# Altium project ultrasonic_tank_monitor.PrjPcb
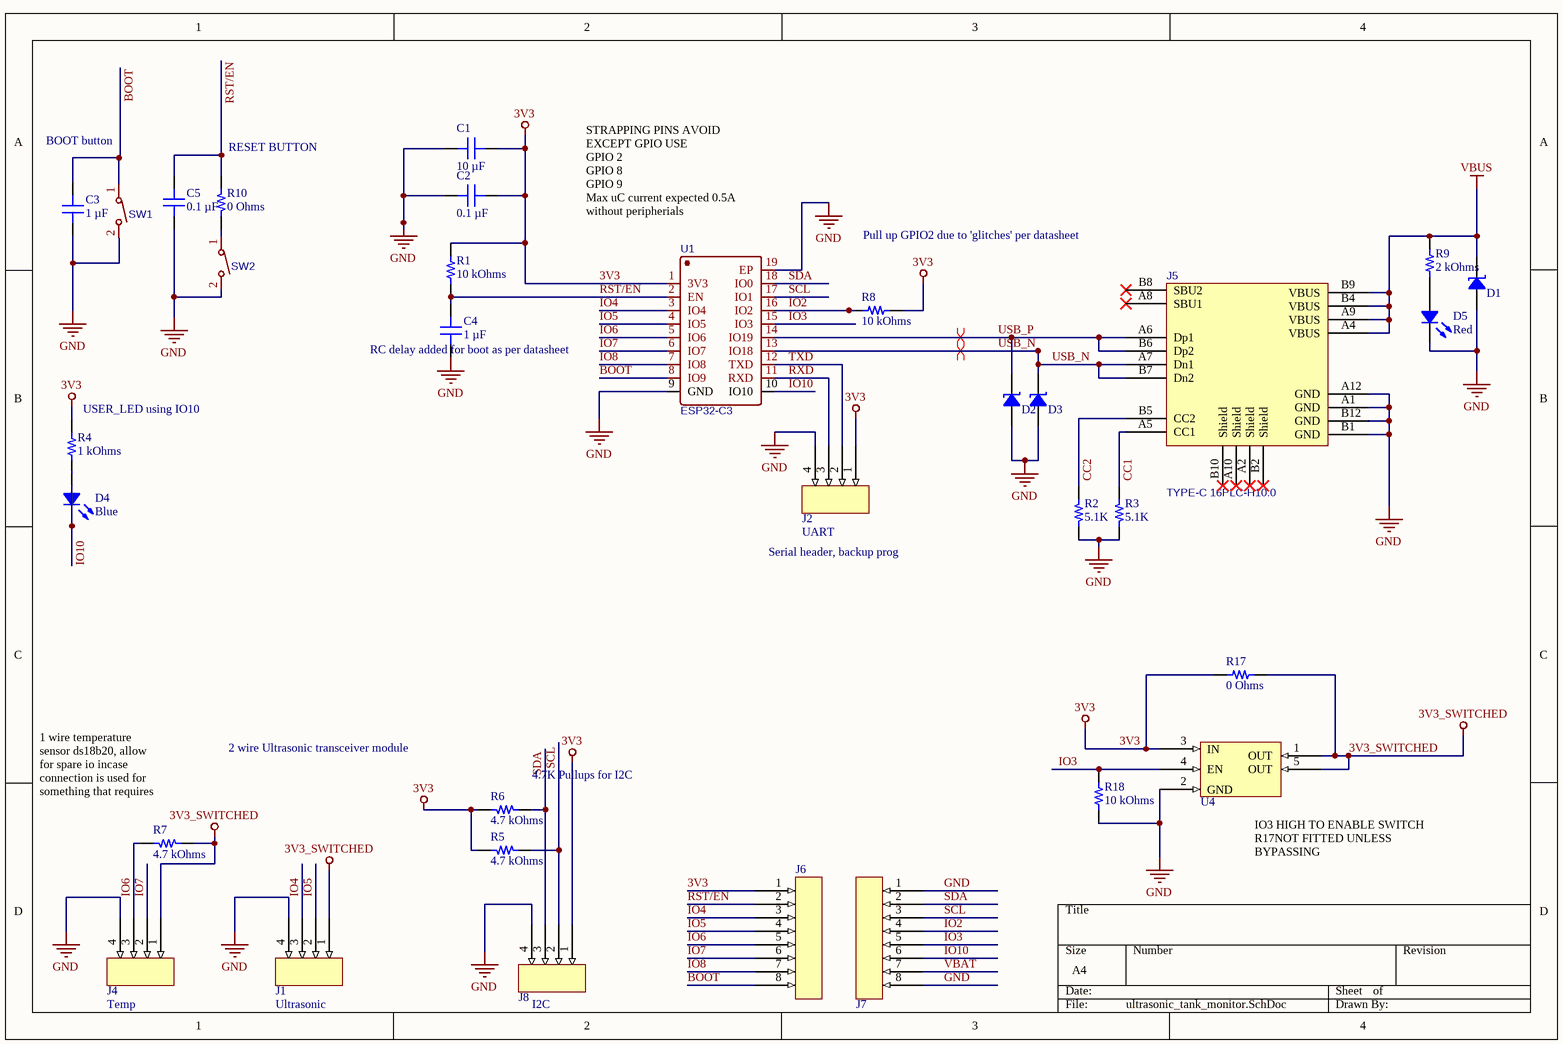
[diagram p0: ultrasonic_tank_monitor.SchDoc]
3 sheets, 63 parts. Net scope: global (net labels, ports and power ports of the same name join across sheets).
Board file: ultrasonic_tank_monitor.PcbDoc
Sheets:
  ultrasonic_tank_monitor.SchDoc
  ultrasonic_tank_monitor_power.SchDoc
  ultrasonic_tank_monitor_battery.SchDoc

## Sheet ultrasonic_tank_monitor.SchDoc
size A4; SheetNumber: 1; SheetTotal: 3

### Parts
C1  10 µF  [CAP 0603_1608]
C2  0.1 µF  [CAP 0603_1608]
C3  1 µF  [CAP 0603_1608]
C4  1 µF  [CAP 0603_1608]
C5  0.1 µF  [CAP 0603_1608]
D1  VESD16C1-02V-G3-08  [SOD523F]  (value not drawn)
D2  VESD16C1-02V-G3-08  [SOD523F]  (value not drawn)
D3  VESD16C1-02V-G3-08  [SOD523F]  (value not drawn)
D4  Blue  [LED 0805_2012 BLUE]
D5  Red  [LED 0805_2012 RED]
J1  Ultrasonic  [HDR-TH_4P-P2.54-V-M]
J2  UART  [HDR-TH_4P-P2.54-V-M]
J4  Temp  [HDR-TH_4P-P2.54-V-M]
J5  TYPE-C 16PLC-H10.0  [TYPE-C-TH_16PLC-H10.0]
J6  HDR-TH_8P-P2.54  [HDR-TH_8P-P2.54-V-M]  (value not drawn)
J7  HDR-TH_8P-P2.54  [HDR-TH_8P-P2.54-V-M]  (value not drawn)
J8  I2C  [HDR-TH_4P-P2.54-V-M]
R1  10 kOhms  [RES 0603_1608]
R2  5.1K  [RES 0603_1608]
R3  5.1K  [RES 0603_1608]
R4  1 kOhms  [RES 0603_1608]
R5  4.7 kOhms  [RES 0603_1608]
R6  4.7 kOhms  [RES 0603_1608]
R7  4.7 kOhms  [RES 0603_1608]
R8  10 kOhms  [RES 0603_1608]
R9  2 kOhms  [RES 0603_1608]
R10  0 Ohms  [RES 0603_1608]
R17  0 Ohms  [RES 1206_3216]
R18  10 kOhms  [RES 0603_1608]
SW1  TS-1185-B-A-B-A  [SW-SMD_L4.0-W3.0-LS5.0]  (value not drawn)
SW2  TS-1185-B-A-B-A  [SW-SMD_L4.0-W3.0-LS5.0]  (value not drawn)
U1  ESP32-C3  [BULETM-SMD_ESPRESSIF_ESP32-C3-WROOM-02-N4-4MB]
U4  AP22818AKBWT-7  [SOT-23-5_L2.9-W1.6-P0.95-LS2.8-BR]  (value not drawn)

### Nets
3V3: C1.2 C2.2 J2.1 J6.1 J8.1 R1.1 R4.2 R5.2 R6.2 R8.2 R17.1 U1.1(3V3) U4.3(IN)
3V3_SWITCHED: J1.1 J4.1 R7.1 R17.2 U4.1(OUT) U4.5(OUT)
GND: C1.1 C2.1 C3.1 C4.1 C5.1 D1.1 D2.1 D3.1 D5.2 J1.4 J2.4 J4.4 J5.A1(GND) J5.A12(GND) J5.B1(GND) J5.B12(GND) J7.1 J7.8 J8.4 R2.1 R3.1 R18.2 SW1.2 SW2.2 U1.9(GND) U1.19(EP) U4.2(GND)
VBAT: J7.7
VBUS: D1.2 J5.A4(VBUS) J5.A9(VBUS) J5.B4(VBUS) J5.B9(VBUS) R9.2
BOOT: C3.2 J6.8 SW1.1 U1.8(IO9)
CC1: J5.A5(CC1) R3.2
CC2: J5.B5(CC2) R2.2
IO2: J7.4 R8.1 U1.16(IO2)
IO3: J7.5 R18.1 U1.15(IO3) U4.4(EN)
IO4: J1.3 J6.3 U1.3(IO4)
IO5: J1.2 J6.4 U1.4(IO5)
IO6: J4.3 J6.5 R7.2 U1.5(IO6)
IO7: J4.2 J6.6 U1.6(IO7)
IO8: J6.7 U1.7(IO8)
IO10: D4.2 J7.6 U1.10(IO10)
RST/EN: C4.2 C5.2 J6.2 R1.2 R10.2 U1.2(EN)
RXD: J2.3 U1.11(RXD)
SCL: J7.3 J8.2 R5.1 U1.17(IO1)
SDA: J7.2 J8.3 R6.1 U1.18(IO0)
TXD: J2.2 U1.12(TXD)
USB_N: D3.2 J5.A7(Dn1) J5.B7(Dn2) U1.13(IO18)
USB_P: D2.2 J5.A6(Dp1) J5.B6(Dp2) U1.14(IO19)
NetD4_1: D4.1 R4.1
NetD5_1: D5.1 R9.1
NetR10_1: R10.1 SW2.1

Not connected (* = marked no-connect by the designer): J5 A2(Shield)* A8(SBU1)* A10(Shield)* B2(Shield)* B8(SBU2)* B10(Shield)*

### Layout directives
differential pair: USB_N, USB_P

### Notes on the sheet
- BOOT button
- (near R10) RESET BUTTON
- (near U1) STRAPPING PINS AVOID EXCEPT GPIO USE
  GPIO 2
  GPIO 8
  GPIO 9
  Max uC current expected 0.5A without peripherials
- Pull up GPIO2 due to 'glitches' per datasheet
- (near C4) RC delay added for boot as per datasheet
- (near R4) USER_LED using IO10
- Serial header, backup prog
- (near R7) 1 wire temperature sensor ds18b20, allow for spare io incase connection is used for something that requires 2 wire
- 2 wire Ultrasonic transceiver module
- (near R6) 4.7K Pullups for I2C
- (near U4) IO3 HIGH TO ENABLE SWITCH
  R17NOT FITTED UNLESS BYPASSING

### Library data of the parts
C1 = GRM188R61A106ME69D: CAP CER 10UF 10V X5R 0603; manufacturer: Murata Electronics; Tolerance: ±20%; Part Number: GRM188R61A106ME69D; Value: 10 µF; Applications: General Purpose; Capacitance: 10 µF; componentlink1description: Datasheet; componentlink1url: https://search.murata.co.jp/Ceramy/image/img/A01X/G101/ENG/GRM188R61A106ME69-01.pdf; componentlink2description: DigiKey Link; componentlink2url: https://www.digikey.com/en/products/detail/murata-electronics/GRM188R61A106ME69D/5027560; Device Package: 0603 (1608 Metric); lastupdated: 3/06/2023 7:12:12 PM; Lifecycle Status: Active; Minimum Order: 1; Mounting Type: Surface Mount, MLCC; Operating Temperature: -55°C ~ 85°C; Package / Case: 0603 (1608 Metric); packaging: TapeAndReel; partid: 11157; Part Status: Active; price: 0.01; series: GRM; Size / Dimension: 0.063" L x 0.031" W (1.60mm x 0.80mm); Supplier 1: DigiKey; Supplier Part Number 1: 490-10475-1-ND; Temperature Coefficient: X5R; Thickness (Max): 0.037" (0.95mm); Voltage - Rated: 10V
C2 C5 = VJ0603Y104MXQCW1BC: CAP CER 0.1UF 10V X7R 0603; manufacturer: Vishay Vitramon; Tolerance: ±20%; Part Number: VJ0603Y104MXQCW1BC; Value: 0.1 µF; Applications: General Purpose; Capacitance: 0.1 µF; componentlink1description: Datasheet; componentlink1url: https://www.vishay.com/docs/28548/vjw1bcbascomseries.pdf; componentlink2description: DigiKey Link; componentlink2url: https://www.digikey.com/en/products/detail/vishay-vitramon/VJ0603Y104MXQCW1BC/8305323; Device Package: 0603 (1608 Metric); lastupdated: 3/06/2023 7:11:16 PM; Lifecycle Status: Active; Minimum Order: 1; Mounting Type: Surface Mount, MLCC; Operating Temperature: -55°C ~ 125°C; Package / Case: 0603 (1608 Metric); packaging: TapeAndReel; partid: 34594; Part Status: Active; price: 0.01; series: VJ W1BC; Size / Dimension: 0.063" L x 0.031" W (1.60mm x 0.80mm); Supplier 1: DigiKey; Supplier Part Number 1: 720-VJ0603Y104MXQCW1BCCT-ND; Temperature Coefficient: X7R; Thickness (Max): 0.034" (0.87mm); Voltage - Rated: 10V
C3 C4 = LMK107B7105KAHT: CAP CER 1UF 10V X7R 0603; manufacturer: Taiyo Yuden; Tolerance: ±10%; Part Number: LMK107B7105KAHT; Value: 1 µF; Applications: Automotive; Capacitance: 1 µF; componentlink1description: Datasheet; componentlink1url: https://ds.yuden.co.jp/TYCOMPAS/ut/detail?pn=LMK107B7105KAHT  &u=M; componentlink2description: DigiKey Link; componentlink2url: https://www.digikey.com/en/products/detail/taiyo-yuden/LMK107B7105KAHT/4157759; Device Package: 0603 (1608 Metric); Lifecycle Status: Active; Minimum Order: 1; Mounting Type: Surface Mount, MLCC; Operating Temperature: -55°C ~ 125°C; Package / Case: 0603 (1608 Metric); packaging: TapeAndReel; partid: 13032; Part Status: Active; price: 0.01; Ratings: AEC-Q200; series: M; Size / Dimension: 0.063" L x 0.031" W (1.60mm x 0.80mm); Supplier 1: DigiKey; Supplier Part Number 1: 587-3410-1-ND; Temperature Coefficient: X7R; Thickness (Max): 0.035" (0.90mm); Voltage - Rated: 10V
  C3: lastupdated: 17/09/2023 7:08:58 PM
  C4: lastupdated: 3/06/2023 7:12:07 PM
D1-D3 = VESD16C1-02V-G3-08: ESD PROTECTION DIODE SOD-523; Manufacturer: Vishay Semiconductor Diodes Division; Capacitance @ Frequency: 27pF @ 1MHz; Current - Peak Pulse (10/1000µs): 3.6A (8/20µs); Power Line Protection: No; Power - Peak Pulse: 100W; Type: Zener; Unidirectional Channels: 1; Voltage - Breakdown (Min): 17V; Voltage - Clamping (Max) @ Ipp: 28V; Voltage - Reverse Standoff (Typ): 16V (Max); Part Number: VESD16C1-02V-G3-08; Applications: Automotive; ComponentLink1Description: Datasheet; ComponentLink1URL: http://www.vishay.com/docs/86130/vesd01c1-02vtovesd33c1-02v.pdf; ComponentLink2Description: DigiKey Link; ComponentLink2URL: http://digikey.com/product-detail/en/vishay-semiconductor-diodes-division/VESD16C1-02V-G3-08/VESD16C1-02V-G3-08GICT-ND/9948019; LastUpdated: 14/08/2023 8:59:27 PM; Lifecycle Status: Active; Minimum Order: 1; Mounting Type: Surface Mount; Operating Temperature: -55°C ~ 150°C (TJ); Package / Case: SC-79, SOD-523; Packaging: TapeAndReel; PartId: 9731; Part Status: Active; Price: 0.06; Series: Automotive, AEC-Q101; Supplier 1: DigiKey; Supplier Part Number 1: VESD16C1-02V-G3-08GICT-ND; Supplier Device Package: SOD-523
D4 = 5973605607F: LED BLUE 0805 SMD; Manufacturer: Dialight; Configuration: Standard; Current - Test: 2mA; Lens Color: 0.93mm; Lens Size: 1.40mm x 1.25mm; Lens Style: Rectangle with Flat Top; Millicandela Rating: 15mcd; Viewing Angle: 130°; Voltage - Forward (Vf) (Typ): 2.8V; Wavelength - Peak: 468nm; Part Number: 5973605607F; Color: Blue; ComponentLink1Description: Datasheet; ComponentLink1URL: http://www.dialightsignalsandcomponents.com/Assets/Drawings/2D_Drawings_DrawingDetailedSpec/NewDrawings/18375A.pdf; ComponentLink2Description: DigiKey Link; ComponentLink2URL: https://www.digikey.com/en/products/detail/dialight/5973605607F/9385449; Device Package: 0805 (2012 Metric); Height (Max): 1.10mm; LastUpdated: 14/08/2023 8:25:57 PM; Lifecycle Status: Active; Minimum Order: 1; Mounting Type: Surface Mount; Package / Case: 0805 (2012 Metric); Packaging: TapeAndReel; PartId: 760; Part Status: Active; Price: 0.08; Series: 597; Size / Dimension: 2.00mm L x 1.25mm W; Supplier 1: DigiKey; Supplier Part Number 1: 350-4394-1-ND; Supplier Device Package: 0805; Value: Blue
D5 = 5990110007F: LED RED 0805 SMD; Manufacturer: Dialight; Configuration: Standard; Current - Test: 20mA; Lens Color: 0.80mm; Lens Size: 1.40mm x 1.25mm; Lens Style: Rectangle with Flat Top; Millicandela Rating: 29mcd; Viewing Angle: 140°; Voltage - Forward (Vf) (Typ): 2.1V; Wavelength - Dominant: 633nm; Part Number: 5990110007F; Color: Red; ComponentLink1Description: Datasheet; ComponentLink1URL: http://www.dialightsignalsandcomponents.com/Assets/Brochures_And_Catalogs/Indication/CBI_SMD_new/Dialight_CBI_data_599-0805_Apr2018.pdf; ComponentLink2Description: DigiKey Link; ComponentLink2URL: https://www.digikey.com/en/products/detail/dialight/5990110007F/9385408; Device Package: 0805 (2012 Metric); Height (Max): 0.80mm; LastUpdated: 15/06/2023 8:27:56 PM; Lifecycle Status: Active; Minimum Order: 1; Mounting Type: Surface Mount; Package / Case: 0805 (2012 Metric); Packaging: TapeAndReel; PartId: 308; Part Status: Active; Price: 0.04; Series: 599; Size / Dimension: 2.00mm L x 1.25mm W; Supplier 1: DigiKey; Supplier Part Number 1: 350-4353-1-ND; Supplier Device Package: 0805; Value: Red
J1 J2 J4 J8 = HDR-TH_4P-P2.54
J5 = TYPE-C 16PLC-H10.0: Manufacturer: SHOU HAN(首韩); Contributor: lcsc; Supplier: LCSC; Supplier Part: C3151747; Manufacturer Part: TYPE-C 16PLC-H10.0; JLCPCB Part Class: Extended Part; spicePre: U; spiceSymbolName: TYPE-C 16PLC-H10.0
R1 R8 R18 = CRCW060310K0JNEB: RES SMD 10K OHM 5% 1/10W 0603; Manufacturer: Vishay Dale; Power (Watts): 0.1W, 1/10W; Temperature Coefficient: ±200ppm/°C; Part Number: CRCW060310K0JNEB; Value: 10 kOhms; ComponentLink1Description: Datasheet; ComponentLink1URL: http://www.vishay.com/docs/20035/dcrcwe3.pdf; ComponentLink2Description: DigiKey Link; ComponentLink2URL: https://www.digikey.com/en/products/detail/vishay-dale/CRCW060310K0JNEB/5070677; Composition: Thick Film; Device Package: 0603 (1608 Metric); Features: Automotive AEC-Q200; Height - Seated (Max): 0.020" (0.50mm); Lifecycle Status: Active; Minimum Order: 1; Number of Terminations: 2; Operating Temperature: -55°C ~ 155°C; Package / Case: 0603 (1608 Metric); Packaging: CutTape; PartId: 56621; Part Status: Active; Price: 0.01; Ratings: AEC-Q200; Resistance: 10 kOhms; Series: CRCW; Size / Dimension: 0.063" L x 0.033" W (1.60mm x 0.85mm); Supplier 1: DigiKey; Supplier Part Number 1: 541-CRCW060310K0JNEBCT-ND; Supplier Device Package: 0603; Tolerance: ±5%
  R1 R18: LastUpdated: 3/06/2023 7:37:02 PM
  R8: LastUpdated: 16/10/2023 7:33:33 PM
R2 R3 = RMEF0603JT5K10: RES 5.1K OHM 5% 1/10W 0603; Manufacturer: Stackpole Electronics Inc; Power (Watts): 0.1W, 1/10W; Ratings: 7C1 RoHS w/out Exemption (100% Pb-Free), AEC-Q200; Resistance: 5.1 kOhms; Temperature Coefficient: ±100ppm/°C; Part Number: RMEF0603JT5K10; Value: 5.1K; ComponentLink1Description: Datasheet; ComponentLink1URL: https://www.seielect.com/Catalog/SEI-RMEF.pdf; ComponentLink2Description: DigiKey Link; ComponentLink2URL: https://www.digikey.com/en/products/detail/stackpole-electronics-inc/RMEF0603JT5K10/16839740; Composition: Thick Film; Device Package: 0603 (1608 Metric); Features: Automotive AEC-Q200; Height - Seated (Max): 0.020" (0.50mm); LastUpdated: 22/08/2023 7:30:12 PM; Lifecycle Status: Active; Minimum Order: 1; Number of Terminations: 2; Operating Temperature: -55°C ~ 155°C; Package / Case: 0603 (1608 Metric); Packaging: TapeAndReel; PartId: 69491; Part Status: Active; Price: 0.01; Series: RMEF; Size / Dimension: 0.063" L x 0.031" W (1.60mm x 0.80mm); Supplier 1: DigiKey; Supplier Part Number 1: 738-RMEF0603JT5K10CT-ND; Supplier Device Package: 0603; Tolerance: ±5%
R4 = WR06X102 JTL: RES 1K OHM 5% 1/10W 0603; Manufacturer: Walsin Technology Corporation; Power (Watts): 0.1W, 1/10W; Temperature Coefficient: ±100ppm/°C; Part Number: WR06X102 JTL; Value: 1 kOhms; ComponentLink1Description: Datasheet; ComponentLink1URL: https://www.passivecomponent.com/wp-content/uploads/chipR/ASC_WR.pdf; ComponentLink2Description: DigiKey Link; ComponentLink2URL: https://www.digikey.com/en/products/detail/walsin-technology-corporation/WR06X102-JTL/13241138; Composition: Thick Film; Device Package: 0603 (1608 Metric); Height - Seated (Max): 0.024" (0.60mm); LastUpdated: 14/08/2023 7:39:30 PM; Lifecycle Status: Active; Minimum Order: 1; Number of Terminations: 2; Operating Temperature: -55°C ~ 155°C; Package / Case: 0603 (1608 Metric); Packaging: CutTape; PartId: 61985; Part Status: Active; Price: 0.01; Resistance: 1 kOhms; Series: WR; Size / Dimension: 0.063" L x 0.031" W (1.60mm x 0.80mm); Supplier 1: DigiKey; Supplier Part Number 1: 1292-WR06X102JTLCT-ND; Supplier Device Package: 0603; Tolerance: ±5%
R5-R7 = WR06X4701FTL: RES 4.7K OHM 1% 1/10W 0603; Manufacturer: Walsin Technology Corporation; Power (Watts): 0.1W, 1/10W; Temperature Coefficient: ±100ppm/°C; Part Number: WR06X4701FTL; Value: 4.7 kOhms; ComponentLink1Description: Datasheet; ComponentLink1URL: https://www.passivecomponent.com/wp-content/uploads/chipR/ASC_WR.pdf; ComponentLink2Description: DigiKey Link; ComponentLink2URL: https://www.digikey.com/en/products/detail/walsin-technology-corporation/WR06X4701FTL/13240840; Composition: Thick Film; Device Package: 0603 (1608 Metric); Height - Seated (Max): 0.024" (0.60mm); LastUpdated: 31/08/2023 7:31:34 PM; Lifecycle Status: Active; Minimum Order: 1; Number of Terminations: 2; Operating Temperature: -55°C ~ 155°C; Package / Case: 0603 (1608 Metric); Packaging: CutTape; PartId: 67913; Part Status: Active; Price: 0.01; Resistance: 4.7 kOhms; Series: WR; Size / Dimension: 0.063" L x 0.031" W (1.60mm x 0.80mm); Supplier 1: DigiKey; Supplier Part Number 1: 1292-WR06X4701FTLCT-ND; Supplier Device Package: 0603; Tolerance: ±1%
R9 = RC0603JR-102KL: RES 2K OHM 5% 1/10W 0603; Manufacturer: Yageo; Power (Watts): 0.1W, 1/10W; Temperature Coefficient: ±100ppm/°C; Part Number: RC0603JR-102KL; Value: 2 kOhms; ComponentLink1Description: Datasheet; ComponentLink1URL: https://www.yageo.com/upload/media/product/productsearch/datasheet/rchip/PYu-RC_Group_51_RoHS_L_11.pdf; ComponentLink2Description: DigiKey Link; ComponentLink2URL: https://www.digikey.com/en/products/detail/yageo/RC0603JR-102KL/14286411; Composition: Thick Film; Device Package: 0603 (1608 Metric); Height - Seated (Max): 0.022" (0.55mm); LastUpdated: 14/08/2023 7:39:28 PM; Lifecycle Status: Active; Minimum Order: 1; Number of Terminations: 2; Operating Temperature: -55°C ~ 155°C; Package / Case: 0603 (1608 Metric); Packaging: CutTape; PartId: 65479; Part Status: Active; Price: 0.01; Resistance: 2 kOhms; Series: RC_L; Size / Dimension: 0.063" L x 0.031" W (1.60mm x 0.80mm); Supplier 1: DigiKey; Supplier Part Number 1: 13-RC0603JR-102KLCT-ND; Supplier Device Package: 0603; Tolerance: ±5%
R10 = WR06X000 PTL: RES SMD 0.0 JUMPER 1/10W 0603; Manufacturer: Walsin Technology Corporation; Part Number: WR06X000 PTL; Value: 0 Ohms; ComponentLink2Description: DigiKey Link; ComponentLink2URL: https://www.digikey.com/en/products/detail/walsin-technology-corporation/WR06X000-PTL/5978108; Composition: Thick Film; Device Package: 0603 (1608 Metric); Height - Seated (Max): 0.024" (0.60mm); LastUpdated: 15/06/2023 7:41:49 PM; Lifecycle Status: Active; Minimum Order: 1; Number of Terminations: 2; Operating Temperature: -55°C ~ 155°C; Package / Case: 0603 (1608 Metric); Packaging: CutTape; PartId: 77887; Part Status: Active; Price: 0.01; Resistance: 0 Ohms; Series: WR; Size / Dimension: 0.063" L x 0.031" W (1.60mm x 0.80mm); Supplier 1: DigiKey; Supplier Part Number 1: 1292-WR06X000PTLCT-ND; Supplier Device Package: 0603; Tolerance: Jumper
R17 = RCL06120000Z0EA: RES SMD 0 OHM 3/4W 1206 WIDE; Manufacturer: Vishay Dale; Power (Watts): 0.75W, 3/4W; Tolerance: Jumper; Part Number: RCL06120000Z0EA; ComponentLink1Description: Datasheet; ComponentLink1URL: http://www.vishay.com/docs/20046/rcle3.pdf; ComponentLink2Description: DigiKey Link; ComponentLink2URL: https://www.digikey.com/en/products/detail/vishay-dale/RCL06120000Z0EA/2587612; Composition: Thick Film; Device Package: 1206 (3216 Metric); Features: Automotive AEC-Q200; Height - Seated (Max): 0.026" (0.65mm); LastUpdated: 17/09/2023 7:43:47 PM; Lifecycle Status: Active; Minimum Order: 1; Number of Terminations: 2; Operating Temperature: -55°C ~ 155°C; Package / Case: 1206 (3216 Metric); Packaging: TapeAndReel; PartId: 66283; Part Status: Active; Price: 0.02; Ratings: AEC-Q200; Resistance: 0 Ohms; Series: RCL; Size / Dimension: 0.063" L x 0.126" W (1.60mm x 3.20mm); Supplier 1: DigiKey; Supplier Part Number 1: RCL0.0CCT-ND; Supplier Device Package: 0612; Value: 0 Ohms
SW1 SW2 = TS-1185-B-A-B-A: Tactile Switch SMD 4x3x2 50mA; Manufacturer: XKB Connectivity(中国星坤); Contributor: LCSC; Supplier: LCSC; Supplier Part: C561517; Manufacturer Part: TS-1185-B-A-B-A; JLCPCB Part Class: Extended Part; spicePre: S; spiceSymbolName: TS-1185-B-A-B-A
U1 = ESP32-C3-WROOM-02-N4(4MB): Manufacturer: ESPRESSIF(乐鑫); Contributor: LCSC; Supplier: LCSC; Supplier Part: C2934560; Manufacturer Part: ESP32-C3-WROOM-02-N4; JLCPCB Part Class: Extended Part; spicePre: U; spiceSymbolName: ESP32-C3-WROOM-02-N4(4MB)
U4 = AP22818AKBWT-7: High active 2A load distribution switch

## Sheet ultrasonic_tank_monitor_power.SchDoc
size A4; SheetNumber: 2; SheetTotal: 3
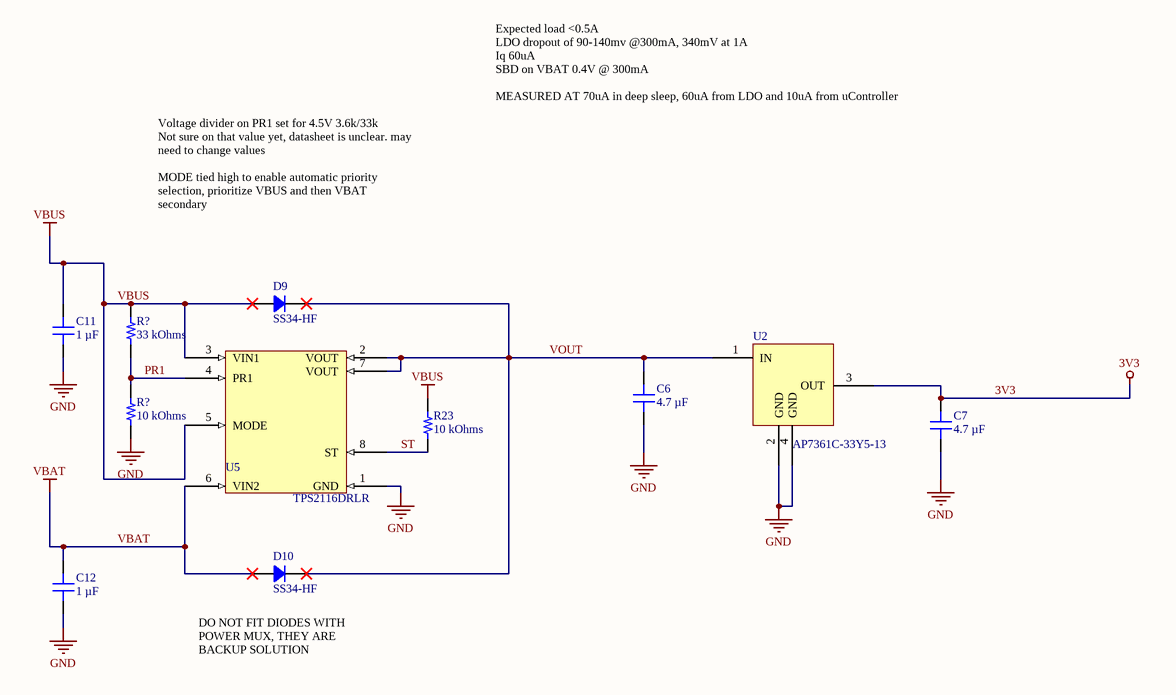
[diagram p1: ultrasonic_tank_monitor_power.SchDoc]

### Parts
(Parts that share a designator on the sheet are numbered #1, #2 ... from top to bottom, then left to right.)
C6  4.7 µF  [CAP 0603_1608]
C7  4.7 µF  [CAP 0603_1608]
C11  1 µF  [CAP 0603_1608]
C12  1 µF  [CAP 0603_1608]
D9  SS34-HF  [DO214AC SMA]
D10  SS34-HF  [DO214AC SMA]
R23  10 kOhms  [RES 0603_1608]
R?#1  33 kOhms  [RES 0603_1608]
R?#2  10 kOhms  [RES 0603_1608]
U2  AP7361C-33Y5-13  [SOT-223_L6.5-W3.5-P2.30-LS7.0-BR]
U5  TPS2116DRLR  [SOT-583-8_L2.1-W1.6-P0.50-LS1.6-BL]

### Nets
3V3: C7.2 U2.3(OUT)
GND: C6.1 C7.1 C11.1 C12.1 R?#2.1 U2.2(GND) U2.4(GND) U5.1(GND)
VBAT: C12.2 D10.1 U5.6(VIN2)
VBUS: C11.2 D9.1 R23.2 R?#1.2 U5.3(VIN1) U5.5(MODE)
PR1: R?#1.1 R?#2.2 U5.4(PR1)
ST: R23.1 U5.8(ST)
VOUT: C6.2 D9.2 D10.2 U2.1(IN) U5.2(VOUT) U5.7(VOUT)

### Notes on the sheet
- Voltage divider on PR1 set for 4.5V 3.6k/33k
  Not sure on that value yet, datasheet is unclear. may need to change values
  MODE tied high to enable automatic priority selection, prioritize VBUS and then VBAT secondary
- Expected load <0.5A
  LDO dropout of 90-140mv @300mA, 340mV at 1A
  Iq 60uA
  SBD on VBAT 0.4V @ 300mA
  MEASURED AT 70uA in deep sleep, 60uA from LDO and 10uA from uController
- (near D10) DO NOT FIT DIODES WITH POWER MUX, THEY ARE BACKUP SOLUTION

### Library data of the parts
C6 C7 = GRM188Z71C475KE21J: CAP CER 4.7UF 16V X7R 0603; manufacturer: Murata Electronics; Tolerance: ±10%; Part Number: GRM188Z71C475KE21J; Value: 4.7 µF; Applications: General Purpose; Capacitance: 4.7 µF; componentlink1description: Datasheet; componentlink1url: https://search.murata.co.jp/Ceramy/image/img/A01X/G101/ENG/GRM188Z71C475KE21-01A.pdf; componentlink2description: DigiKey Link; componentlink2url: https://www.digikey.com/en/products/detail/murata-electronics/GRM188Z71C475KE21J/16033436; Device Package: 0603 (1608 Metric); lastupdated: 15/10/2023 7:08:11 PM; Lifecycle Status: Active; Minimum Order: 1; Mounting Type: Surface Mount, MLCC; Operating Temperature: -55°C ~ 125°C; Package / Case: 0603 (1608 Metric); packaging: TapeAndReel; partid: 41988; Part Status: Active; price: 0.04; series: GRM; Size / Dimension: 0.063" L x 0.031" W (1.60mm x 0.80mm); Supplier 1: DigiKey; Supplier Part Number 1: 490-GRM188Z71C475KE21JCT-ND; Temperature Coefficient: X7R; Thickness (Max): 0.039" (1.00mm); Voltage - Rated: 16V
C11 C12 = LMK107B7105KAHT: as C3 on sheet ultrasonic_tank_monitor; Part Number: LMK107B7105KAHT; Value: 1 µF; Applications: Automotive; Capacitance: 1 µF; componentlink1description: Datasheet; componentlink1url: https://ds.yuden.co.jp/TYCOMPAS/ut/detail?pn=LMK107B7105KAHT  &u=M; componentlink2description: DigiKey Link; componentlink2url: https://www.digikey.com/en/products/detail/taiyo-yuden/LMK107B7105KAHT/4157759; Device Package: 0603 (1608 Metric); lastupdated: 17/09/2023 7:08:58 PM; Lifecycle Status: Active; Minimum Order: 1; Mounting Type: Surface Mount, MLCC; Operating Temperature: -55°C ~ 125°C; Package / Case: 0603 (1608 Metric); packaging: TapeAndReel; partid: 13032; Part Status: Active; price: 0.01; Ratings: AEC-Q200; series: M; Size / Dimension: 0.063" L x 0.031" W (1.60mm x 0.80mm); Supplier 1: DigiKey; Supplier Part Number 1: 587-3410-1-ND; Temperature Coefficient: X7R; Thickness (Max): 0.035" (0.90mm); Voltage - Rated: 10V
D9 D10 = SS34-HF: DIODE SCHOTTKY 40V 3A DO214AC; Manufacturer: Comchip Technology; Capacitance @ Vr, F: 450pF @ 4V, 1MHz; Current - Reverse Leakage @ Vr: 500 µA @ 40 V; Speed: Fast Recovery =< 500ns, > 200mA (Io); Voltage - Forward (Vf) (Max) @ If: 550 mV @ 3 A; Part Number: SS34-HF; ComponentLink1Description: Datasheet; ComponentLink1URL: http://www.comchiptech.com/admin/files/product/20190514101641.pdf; ComponentLink2Description: DigiKey Link; ComponentLink2URL: https://www.digikey.com/en/products/detail/comchip-technology/SS34-HF/10279693; Current - Average Rectified (Io): 3A; Diode Type: Schottky; LastUpdated: 7/08/2023 8:38:18 PM; Lifecycle Status: Active; Minimum Order: 1; Mounting Type: Surface Mount; Operating Temperature - Junction: -55°C ~ 125°C; Package / Case: DO-214AC, SMA; Packaging: TapeAndReel; PartId: 2138; Part Status: Active; Price: 0.07; Series: -; Supplier 1: DigiKey; Supplier Part Number 1: 641-2115-1-ND; Supplier Device Package: DO-214AC (SMA); Voltage - DC Reverse (Vr) (Max): 40 V
R23 R?#2 = CRCW060310K0JNEB: as R1 on sheet ultrasonic_tank_monitor; Part Number: CRCW060310K0JNEB; Value: 10 kOhms; ComponentLink1Description: Datasheet; ComponentLink1URL: http://www.vishay.com/docs/20035/dcrcwe3.pdf; ComponentLink2Description: DigiKey Link; ComponentLink2URL: https://www.digikey.com/en/products/detail/vishay-dale/CRCW060310K0JNEB/5070677; Composition: Thick Film; Device Package: 0603 (1608 Metric); Features: Automotive AEC-Q200; Height - Seated (Max): 0.020" (0.50mm); LastUpdated: 3/06/2023 7:37:02 PM; Lifecycle Status: Active; Minimum Order: 1; Number of Terminations: 2; Operating Temperature: -55°C ~ 155°C; Package / Case: 0603 (1608 Metric); Packaging: CutTape; PartId: 56621; Part Status: Active; Price: 0.01; Ratings: AEC-Q200; Resistance: 10 kOhms; Series: CRCW; Size / Dimension: 0.063" L x 0.033" W (1.60mm x 0.85mm); Supplier 1: DigiKey; Supplier Part Number 1: 541-CRCW060310K0JNEBCT-ND; Supplier Device Package: 0603; Tolerance: ±5%
R?#1 = WR06X3302FTL: RES 33K OHM 1% 1/10W 0603; Manufacturer: Walsin Technology Corporation; Power (Watts): 0.1W, 1/10W; Temperature Coefficient: ±100ppm/°C; Part Number: WR06X3302FTL; Value: 33 kOhms; ComponentLink1Description: Datasheet; ComponentLink1URL: https://www.passivecomponent.com/wp-content/uploads/chipR/ASC_WR.pdf; ComponentLink2Description: DigiKey Link; ComponentLink2URL: https://www.digikey.com/en/products/detail/walsin-technology-corporation/WR06X3302FTL/13239167; Composition: Thick Film; Device Package: 0603 (1608 Metric); Height - Seated (Max): 0.024" (0.60mm); LastUpdated: 16/10/2023 7:33:13 PM; Lifecycle Status: Active; Minimum Order: 1; Number of Terminations: 2; Operating Temperature: -55°C ~ 155°C; Package / Case: 0603 (1608 Metric); Packaging: CutTape; PartId: 62382; Part Status: Active; Price: 0.01; Resistance: 33 kOhms; Series: WR; Size / Dimension: 0.063" L x 0.031" W (1.60mm x 0.80mm); Supplier 1: DigiKey; Supplier Part Number 1: 1292-WR06X3302FTLCT-ND; Supplier Device Package: 0603; Tolerance: ±1%
U2 = AP7361C-33Y5-13: 3V3 LDO low drop out and low Iq
U5 = TPS2116DRLR: 2 IN 1 OUT Power MUX 1.6-5.5V 2.5A low-IQ

## Sheet ultrasonic_tank_monitor_battery.SchDoc
size A4; SheetNumber: 3; SheetTotal: 3
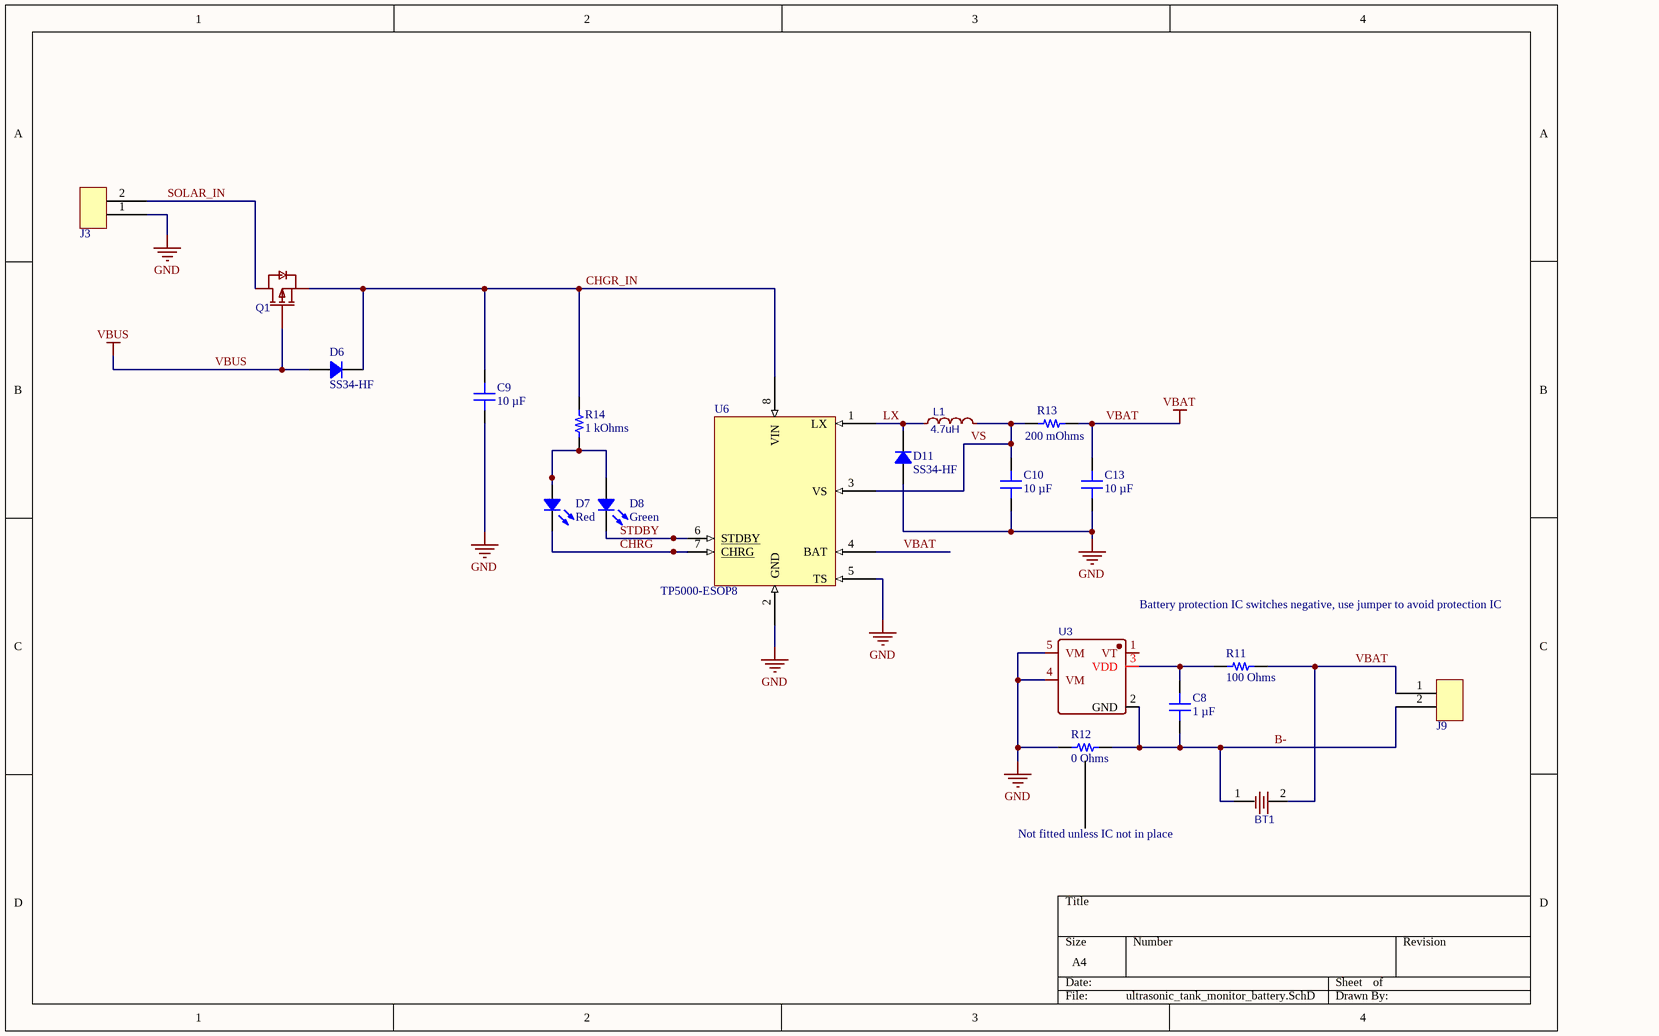
[diagram p2: ultrasonic_tank_monitor_battery.SchDoc]

### Parts
BT1  BH-18650-B1BA002  [BATTERY-SMD_18650-1S-L77.1-W20.7-1]  (value not drawn)
C8  1 µF  [CAP 0603_1608]
C9  10 µF  [CAP 0603_1608]
C10  10 µF  [CAP 0603_1608]
C13  10 µF  [CAP 0603_1608]
D6  SS34-HF  [DO214AC SMA]
D7  Red  [LED 0805_2012 RED]
D8  Green  [LED 0805_2012 GREEN]
D11  SS34-HF  [DO214AC SMA]
J3  B2B-PH-K-S  [CONN-TH_B2B-PH-K-S]  (value not drawn)
J9  S2B-PH-K-S  [CONN-TH_S2B-PH-K-S-LF-SN]  (value not drawn)
L1  4.7uH  [IND-SMD_L5.2-W5.2_YSPI0530]
Q1  SI2301-ZE  [SOT-23-3_L2.9-W1.3-P1.90-LS2.4-BR]  (value not drawn)
R11  100 Ohms  [RES 0603_1608]
R12  0 Ohms  [RES 1206_3216]
R13  200 mOhms  [RES 1206_3216]
R14  1 kOhms  [RES 0603_1608]
U3  SKCL3130ME  [SOT-23-5_L2.9-W1.6-P0.95-LS2.8-BR]  (value not drawn)
U6  TP5000-ESOP8  [ESOP-8_L4.9-W3.9-P1.27-LS6.0-BL-EP]

### Nets
GND: C9.1 C10.1 C13.1 D11.1 J3.1 R12.1 U3.4(VM) U3.5(VM) U6.2(GND) U6.5(TS)
VBAT: BT1.2 C13.2 J9.1 R11.2 R13.2 U6.4(BAT)
VBUS: D6.1 Q1.1(G)
B-: BT1.1 C8.2 J9.2 R12.2 U3.2(GND)
CHGR_IN: C9.2 D6.2 Q1.2(S) R14.1 U6.8(VIN)
CHRG: D7.2 U6.7(CHRG)
LX: D11.2 L1.1 U6.1(LX)
SOLAR_IN: J3.2 Q1.3(D)
STDBY: D8.2 U6.6(STDBY)
VS: C10.2 L1.2 R13.1 U6.3(VS)
NetC8_1: C8.1 R11.1 U3.3(VDD)
NetD7_1: D7.1 D8.1 R14.2

Not connected (* = marked no-connect by the designer): U3 1(VT)

### Notes on the sheet
- Battery protection IC switches negative, use jumper to avoid protection IC
- (near BT1) Not fitted unless IC not in place

### Library data of the parts
BT1 = 18650 SMD battery holder: Manufacturer: MYOUNG(美阳); Contributor: lcsc; Supplier: LCSC; Supplier Part: C2988620; Manufacturer Part: BH-18650-B1BA002; JLCPCB Part Class: Extended Part; spicePre: B; spiceSymbolName: BH-18650-B1BA002
C8 = LMK107B7105KAHT: as C3 on sheet ultrasonic_tank_monitor; Part Number: LMK107B7105KAHT; Value: 1 µF; Applications: Automotive; Capacitance: 1 µF; componentlink1description: Datasheet; componentlink1url: https://ds.yuden.co.jp/TYCOMPAS/ut/detail?pn=LMK107B7105KAHT  &u=M; componentlink2description: DigiKey Link; componentlink2url: https://www.digikey.com/en/products/detail/taiyo-yuden/LMK107B7105KAHT/4157759; Device Package: 0603 (1608 Metric); lastupdated: 3/06/2023 7:12:07 PM; Lifecycle Status: Active; Minimum Order: 1; Mounting Type: Surface Mount, MLCC; Operating Temperature: -55°C ~ 125°C; Package / Case: 0603 (1608 Metric); packaging: TapeAndReel; partid: 13032; Part Status: Active; price: 0.01; Ratings: AEC-Q200; series: M; Size / Dimension: 0.063" L x 0.031" W (1.60mm x 0.80mm); Supplier 1: DigiKey; Supplier Part Number 1: 587-3410-1-ND; Temperature Coefficient: X7R; Thickness (Max): 0.035" (0.90mm); Voltage - Rated: 10V
C9 C10 C13 = GRM188R61A106ME69D: as C1 on sheet ultrasonic_tank_monitor; Part Number: GRM188R61A106ME69D; Value: 10 µF; Applications: General Purpose; Capacitance: 10 µF; componentlink1description: Datasheet; componentlink1url: https://search.murata.co.jp/Ceramy/image/img/A01X/G101/ENG/GRM188R61A106ME69-01.pdf; componentlink2description: DigiKey Link; componentlink2url: https://www.digikey.com/en/products/detail/murata-electronics/GRM188R61A106ME69D/5027560; Device Package: 0603 (1608 Metric); lastupdated: 3/06/2023 7:12:12 PM; Lifecycle Status: Active; Minimum Order: 1; Mounting Type: Surface Mount, MLCC; Operating Temperature: -55°C ~ 85°C; Package / Case: 0603 (1608 Metric); packaging: TapeAndReel; partid: 11157; Part Status: Active; price: 0.01; series: GRM; Size / Dimension: 0.063" L x 0.031" W (1.60mm x 0.80mm); Supplier 1: DigiKey; Supplier Part Number 1: 490-10475-1-ND; Temperature Coefficient: X5R; Thickness (Max): 0.037" (0.95mm); Voltage - Rated: 10V
D6 D11 = SS34-HF: as D9 on sheet ultrasonic_tank_monitor_power; Part Number: SS34-HF; ComponentLink1Description: Datasheet; ComponentLink1URL: http://www.comchiptech.com/admin/files/product/20190514101641.pdf; ComponentLink2Description: DigiKey Link; ComponentLink2URL: https://www.digikey.com/en/products/detail/comchip-technology/SS34-HF/10279693; Current - Average Rectified (Io): 3A; Diode Type: Schottky; LastUpdated: 7/08/2023 8:38:18 PM; Lifecycle Status: Active; Minimum Order: 1; Mounting Type: Surface Mount; Operating Temperature - Junction: -55°C ~ 125°C; Package / Case: DO-214AC, SMA; Packaging: TapeAndReel; PartId: 2138; Part Status: Active; Price: 0.07; Series: -; Supplier 1: DigiKey; Supplier Part Number 1: 641-2115-1-ND; Supplier Device Package: DO-214AC (SMA); Voltage - DC Reverse (Vr) (Max): 40 V
D7 = 5990110007F: as D5 on sheet ultrasonic_tank_monitor; Part Number: 5990110007F; Color: Red; ComponentLink1Description: Datasheet; ComponentLink1URL: http://www.dialightsignalsandcomponents.com/Assets/Brochures_And_Catalogs/Indication/CBI_SMD_new/Dialight_CBI_data_599-0805_Apr2018.pdf; ComponentLink2Description: DigiKey Link; ComponentLink2URL: https://www.digikey.com/en/products/detail/dialight/5990110007F/9385408; Device Package: 0805 (2012 Metric); Height (Max): 0.80mm; LastUpdated: 15/06/2023 8:27:56 PM; Lifecycle Status: Active; Minimum Order: 1; Mounting Type: Surface Mount; Package / Case: 0805 (2012 Metric); Packaging: TapeAndReel; PartId: 308; Part Status: Active; Price: 0.04; Series: 599; Size / Dimension: 2.00mm L x 1.25mm W; Supplier 1: DigiKey; Supplier Part Number 1: 350-4353-1-ND; Supplier Device Package: 0805; Value: Red
D8 = 5990181007F: LED GREEN 0805 SMD; Manufacturer: Dialight; Configuration: Standard; Current - Test: 20mA; Lens Color: 0.80mm; Lens Size: 1.40mm x 1.25mm; Lens Style: Rectangle with Flat Top; Millicandela Rating: 340mcd; Viewing Angle: 140°; Voltage - Forward (Vf) (Typ): 3.2V; Wavelength - Dominant: 525nm; Part Number: 5990181007F; Color: Green; ComponentLink1Description: Datasheet; ComponentLink1URL: http://www.dialightsignalsandcomponents.com/Assets/Brochures_And_Catalogs/Indication/CBI_SMD_new/Dialight_CBI_data_599-0805_Apr2018.pdf; ComponentLink2Description: DigiKey Link; ComponentLink2URL: https://www.digikey.com/en/products/detail/dialight/5990181007F/9385413; Device Package: 0805 (2012 Metric); Height (Max): 0.80mm; LastUpdated: 15/06/2023 8:28:13 PM; Lifecycle Status: Active; Minimum Order: 1; Mounting Type: Surface Mount; Package / Case: 0805 (2012 Metric); Packaging: TapeAndReel; PartId: 272; Part Status: Active; Price: 0.15; Series: 599; Size / Dimension: 2.00mm L x 1.25mm W; Supplier 1: DigiKey; Supplier Part Number 1: 350-4358-1-ND; Supplier Device Package: 0805; Value: Green
J3 = B2B-PH-K-S: 2 Pin JST PH 2.0 Connector Straight
J9 = S2B-PH-K-S: 2 Pin JST PH 2.0 Connector RA
L1 = 4.7uH 5.2x5.4 SMD 3.5A: 2.2uH 1.5A Power Inductor 3x3; Manufacturer: TAIYO YUDEN(太诱); Manufacturer Part: NR3015T2R2M; nameAlias: Value; Supplier: LCSC; Supplier Part: C86423; JLCPCB Part Class: Extended Part; spicePre: L; spiceSymbolName: NR3015T2R2M
Q1 = SI2301-ZE: P-CHAN Mosfet SI2301; Manufacturer: HXY MOSFET(华轩阳电子); Contributor: lcsc; Supplier: LCSC; Supplier Part: C5261052; Manufacturer Part: SI2301-ZE; JLCPCB Part Class: Extended Part; spicePre: U; spiceSymbolName: SI2301-ZE
R11 = WR06X101 JTL: RES 100 OHM 5% 1/10W 0603; Manufacturer: Walsin Technology Corporation; Power (Watts): 0.1W, 1/10W; Temperature Coefficient: ±100ppm/°C; Part Number: WR06X101 JTL; Value: 100 Ohms; ComponentLink1Description: Datasheet; ComponentLink1URL: https://www.passivecomponent.com/wp-content/uploads/chipR/ASC_WR.pdf; ComponentLink2Description: DigiKey Link; ComponentLink2URL: https://www.digikey.com/en/products/detail/walsin-technology-corporation/WR06X101-JTL/13241290; Composition: Thick Film; Device Package: 0603 (1608 Metric); Height - Seated (Max): 0.024" (0.60mm); LastUpdated: 17/09/2023 7:32:41 PM; Lifecycle Status: Active; Minimum Order: 1; Number of Terminations: 2; Operating Temperature: -55°C ~ 155°C; Package / Case: 0603 (1608 Metric); Packaging: CutTape; PartId: 62337; Part Status: Active; Price: 0.01; Resistance: 100 Ohms; Series: WR; Size / Dimension: 0.063" L x 0.031" W (1.60mm x 0.80mm); Supplier 1: DigiKey; Supplier Part Number 1: 1292-WR06X101JTLCT-ND; Supplier Device Package: 0603; Tolerance: ±5%
R12 = RCL06120000Z0EA: as R17 on sheet ultrasonic_tank_monitor; Part Number: RCL06120000Z0EA; ComponentLink1Description: Datasheet; ComponentLink1URL: http://www.vishay.com/docs/20046/rcle3.pdf; ComponentLink2Description: DigiKey Link; ComponentLink2URL: https://www.digikey.com/en/products/detail/vishay-dale/RCL06120000Z0EA/2587612; Composition: Thick Film; Device Package: 1206 (3216 Metric); Features: Automotive AEC-Q200; Height - Seated (Max): 0.026" (0.65mm); LastUpdated: 17/09/2023 7:43:47 PM; Lifecycle Status: Active; Minimum Order: 1; Number of Terminations: 2; Operating Temperature: -55°C ~ 155°C; Package / Case: 1206 (3216 Metric); Packaging: TapeAndReel; PartId: 66283; Part Status: Active; Price: 0.02; Ratings: AEC-Q200; Resistance: 0 Ohms; Series: RCL; Size / Dimension: 0.063" L x 0.126" W (1.60mm x 3.20mm); Supplier 1: DigiKey; Supplier Part Number 1: RCL0.0CCT-ND; Supplier Device Package: 0612; Value: 0 Ohms
R13 = PT1206FR-7W0R2L: RES 0.2 OHM 1% 1/2W 1206; Manufacturer: Yageo; Power (Watts): 0.5W, 1/2W; Temperature Coefficient: ±75ppm/°C; Part Number: PT1206FR-7W0R2L; ComponentLink1Description: Datasheet; ComponentLink1URL: https://www.yageo.com/upload/media/product/productsearch/datasheet/rchip/PYu-PT-Group_521_RoHS_L_2.pdf; ComponentLink2Description: DigiKey Link; ComponentLink2URL: https://www.digikey.com/en/products/detail/yageo/PT1206FR-7W0R2L/5915393; Composition: Thick Film; Device Package: 1206 (3216 Metric); Features: Automotive AEC-Q200, Current Sense, Moisture Resistant; Height - Seated (Max): 0.026" (0.65mm); LastUpdated: 15/10/2023 7:41:45 PM; Lifecycle Status: Active; Minimum Order: 1; Number of Terminations: 2; Operating Temperature: -55°C ~ 155°C; Package / Case: 1206 (3216 Metric); Packaging: TapeAndReel; PartId: 79151; Price: 0.06; Ratings: AEC-Q200; Resistance: 200 mOhms; Series: PT; Size / Dimension: 0.122" L x 0.063" W (3.10mm x 1.60mm); Supplier 1: DigiKey; Supplier Part Number 1: 13-PT1206FR-7W0R2LCT-ND; Supplier Device Package: 1206; Tolerance: ±1%; Value: 200 mOhms
R14 = SR0603JR-7T1KL: RES 1K OHM 5% 1/4W 0603; Manufacturer: Yageo; Power (Watts): 0.25W, 1/4W; Temperature Coefficient: ±100ppm/°C; Part Number: SR0603JR-7T1KL; Value: 1 kOhms; ComponentLink1Description: Datasheet; ComponentLink1URL: http://www.yageo.com/NewPortal/_en/search/productDocs.jsp?YageoPartNumber=SR0603JR-7T1KL; ComponentLink2Description: DigiKey Link; ComponentLink2URL: https://www.digikey.com/en/products/detail/yageo/SR0603JR-7T1KL/9696404; Composition: Thick Film; Device Package: 0603 (1608 Metric); Features: Automotive AEC-Q200, Pulse Withstanding; Height - Seated (Max): 0.022" (0.55mm); LastUpdated: 15/06/2023 7:42:39 PM; Lifecycle Status: Active; Minimum Order: 1; Number of Terminations: 2; Operating Temperature: -55°C ~ 155°C; Package / Case: 0603 (1608 Metric); Packaging: TapeAndReel; PartId: 23945; Part Status: Active; Price: 0.03; Ratings: AEC-Q200; Resistance: 1 kOhms; Series: SR; Size / Dimension: 0.063" L x 0.031" W (1.60mm x 0.80mm); Supplier 1: DigiKey; Supplier Part Number 1: YAG6166CT-ND; Supplier Device Package: 0603; Tolerance: ±5%
U3 = SKCL3130ME: 1 cell battery protection IC Li-ion OC OV UV SOT 23-5; Manufacturer: SHIKUES(时科); Contributor: LCSC; Supplier: LCSC; Supplier Part: C2941741; Manufacturer Part: SKCL3130ME; JLCPCB Part Class: Extended Part; spicePre: U; spiceSymbolName: SKCL3130ME
U6 = TP5000-ESOP8: 1 cell Li-ion / LIFEPO4 cell charger switchmode

## Nets that join several sheets
3V3: ultrasonic_tank_monitor (13 pins), ultrasonic_tank_monitor_power (C7.2 U2.3)
GND: ultrasonic_tank_monitor (27 pins), ultrasonic_tank_monitor_power (8 pins), ultrasonic_tank_monitor_battery (10 pins)
VBAT: ultrasonic_tank_monitor (J7.7), ultrasonic_tank_monitor_power (C12.2 D10.1 U5.6), ultrasonic_tank_monitor_battery (6 pins)
VBUS: ultrasonic_tank_monitor (6 pins), ultrasonic_tank_monitor_power (6 pins), ultrasonic_tank_monitor_battery (D6.1 Q1.1)